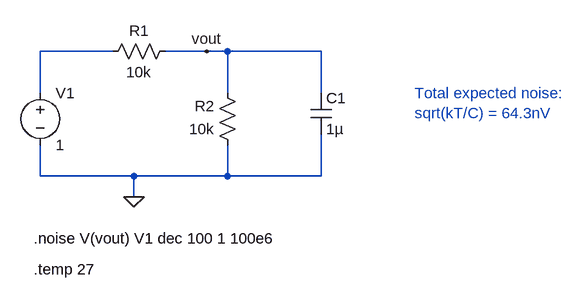
[diagram p0: schematic kT_by_C_noise.asc]
kT_by_C_noise.asc, the LTspice schematic file:
Version 4
SHEET 1 880 680
WIRE 128 128 16 128
WIRE 272 128 208 128
WIRE 304 128 272 128
WIRE 448 128 304 128
WIRE 16 192 16 128
WIRE 304 192 304 128
WIRE 448 192 448 128
WIRE 16 320 16 272
WIRE 160 320 16 320
WIRE 304 320 304 272
WIRE 304 320 160 320
WIRE 448 320 448 256
WIRE 448 320 304 320
WIRE 160 352 160 320
FLAG 160 352 0
FLAG 272 128 vout
SYMBOL res 224 112 R90
WINDOW 0 0 56 VBottom 2
WINDOW 3 32 56 VTop 2
SYMATTR InstName R1
SYMATTR Value 10k
SYMBOL res 320 288 R180
WINDOW 0 36 76 Left 2
WINDOW 3 36 40 Left 2
SYMATTR InstName R2
SYMATTR Value 10k
SYMBOL voltage 16 176 R0
WINDOW 123 0 0 Left 0
WINDOW 39 0 0 Left 0
SYMATTR InstName V1
SYMATTR Value 1
SYMBOL cap 432 192 R0
SYMATTR InstName C1
SYMATTR Value 1µ
TEXT 6 416 Left 2 !.noise V(vout) V1 dec 100 1 100e6
TEXT 592 192 Left 2 ;Total expected noise:\nsqrt(kT/C) = 64.3nV
TEXT 6 464 Left 2 !.temp 27

The netlist it stands for:
* kT_by_C_noise.asc
R1 vout N001 10k
R2 0 vout 10k
V1 N001 0 1
C1 vout 0 1µ
.noise V(vout) V1 dec 100 1 100e6
* Total expected noise:
* sqrt(kT/C) = 64.3nV
.temp 27
.backanno
.end